# Altium schematic sheet USB.SchDoc: USB
size B; Revision: 1
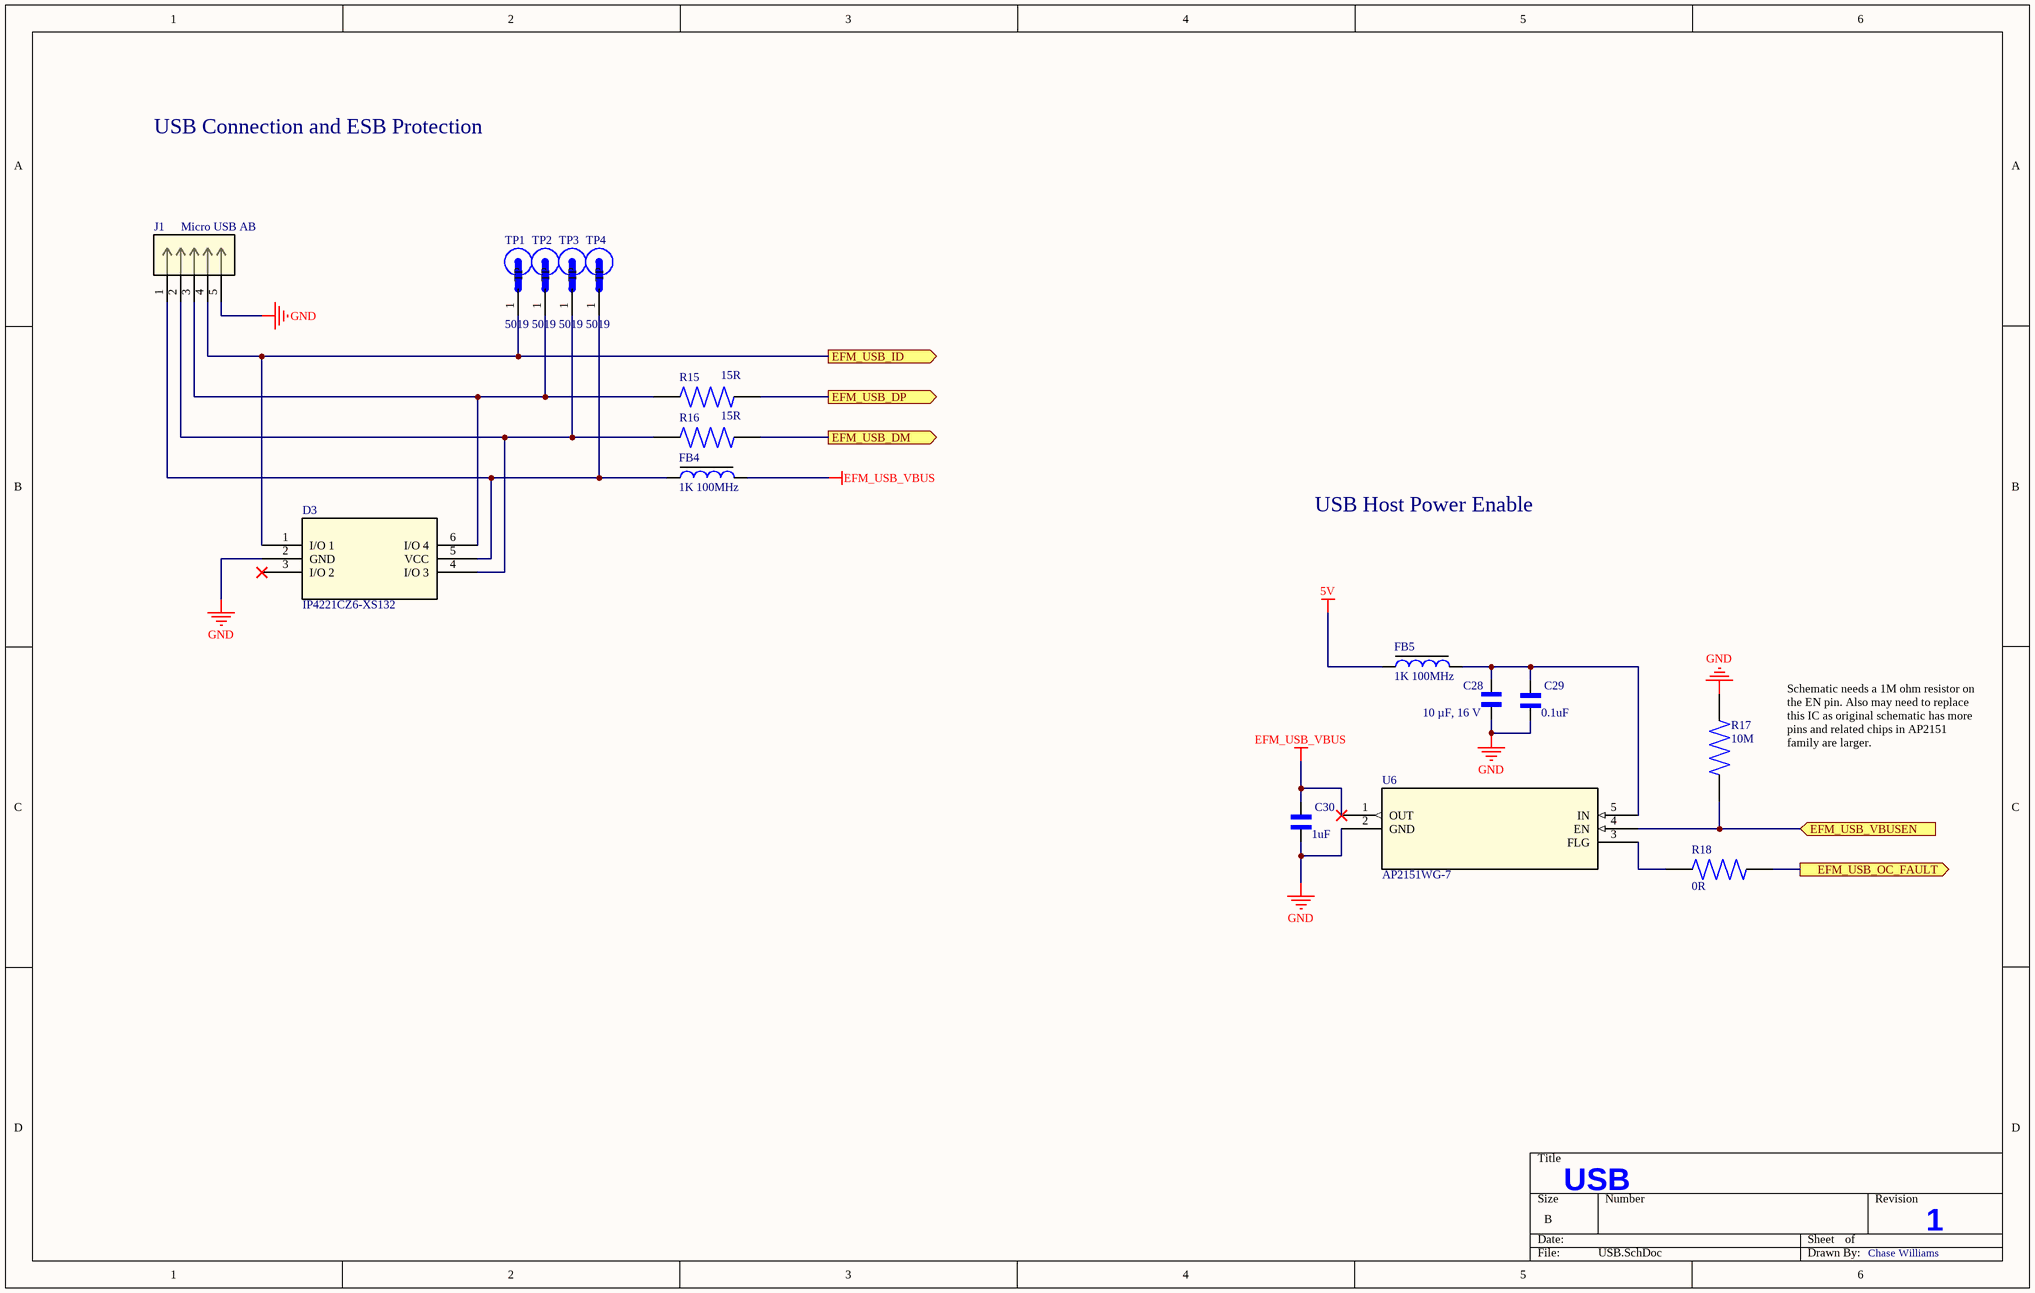
[diagram p0: USB.SchDoc]

## Parts
C28  10 µF, 16 V  [C0805]
C29  0.1uF  [C0402]
C30  1uF  [C0603]
D3  IP4221CZ6-XS132  [SOT886_NEX-M]
FB4  1K 100MHz  [FB0603]
FB5  1K 100MHz  [FB0603]
J1  Micro USB AB  [Molex Micro USB]
R15  15R  [R0402 Vishay]
R16  15R  [R0402 Vishay]
R17  10M  [R0402 Vishay]
R18  0R  [R0805 Yageo]
TP1  5019  [TP380X203]
TP2  5019  [TP380X203]
TP3  5019  [TP380X203]
TP4  5019  [TP380X203]
U6  AP2151WG-7  [AP2151FMG-7]

## Ports
EFM_USB_DM (out), EFM_USB_DP (out), EFM_USB_ID (out), EFM_USB_OC_FAULT (out), EFM_USB_VBUSEN (in)

## Nets
5V: FB5.1
EFM_USB_VBUS: C30.2 FB4.2 U6.1(OUT)
GND: C28.2 C29.1 C30.1 D3.2(GND) J1.5(GND) R17.2 U6.2(GND)
EFM_USB_DM: R16.2 ; port EFM_USB_DM
EFM_USB_DP: R15.2 ; port EFM_USB_DP
EFM_USB_ID: D3.1(I/O_1) J1.4(ID) TP1.1(TP) ; port EFM_USB_ID
EFM_USB_OC_FAULT: R18.2 ; port EFM_USB_OC_FAULT
EFM_USB_VBUSEN: R17.1 U6.4(EN) ; port EFM_USB_VBUSEN
NetC28_1: C28.1 C29.2 FB5.2 U6.5(IN)
NetD3_4: D3.4(I/O_3) J1.2(D-) R16.1 TP3.1(TP)
NetD3_5: D3.5(VCC) FB4.1 J1.1(VBUS) TP4.1(TP)
NetD3_6: D3.6(I/O_4) J1.3(D+) R15.1 TP2.1(TP)
NetR18_1: R18.1 U6.3(FLG)

Not connected (* = marked no-connect by the designer): D3 3(I/O_2)*

## Notes on the sheet
- USB Connection and ESB Protection
- USB Host Power Enable
- Schematic needs a 1M ohm resistor on the EN pin. Also may need to replace this IC as original schematic has more pins and related chips in AP2151 family are larger.
- Chase Williams

## Library data of the parts
C28 = C2012X5R1C106K085AC: TDK - C2012X5R1C106K085AC - SMD Multilayer Ceramic Capacitor, 10 µF, 16 V, 0805 [2012 Metric], ± 10%, X5R, C Series TDK; Capacitance: 10uF; Voltage Rating: 16V; Supplier 1: Digi-Key; Manufacturer: TDK; Manufacturer Part Number: C2012X5R1C106K085AC; RoHS: Yes; Category: Ceramic Capacitors; Stock 1: 1442350; Pricing 1: 1=0.25000, 10=0.17500, 100=0.09890, 500=0.06982, 1000=0.06110 (USD); Mount: Surface Mount; Case/Package: 0805; Number of Pins: 2; Weight: 0.000194oz; Case Code (Metric): 2012; Case Code (Imperial): 0805; Dielectric Material: Ceramic; Min Operating Temperature: -55°C; Max Operating Temperature: 85°C; Tolerance: 10%; Packaging: Tape and Reel; Voltage Rating (DC): 16V; Termination: SMD/SMT; Dielectric: X5R; Package Quantity: 1; Composition: Ceramic; Length: 2mm; Height: 0.85mm; Depth: 1.25mm; Width: 0.049inch; Thickness: 0.037inch; Lead Free: Lead Free; REACH SVHC: No SVHC; ComponentLink1URL: https://datasheet.ciiva.com/24218/c2012x5r1c106k085ac-264980-24218056.pdf?src-supplier=Mouser; ComponentLink1Description: https://datasheet.ciiva.com/24218/c2012x5r1c106k085ac-264980-24218056.pdf?src-supplier=Mouser; ComponentLink2URL: https://datasheet.ciiva.com/28451/1796654-28451610.pdf?src-supplier=Element14; ComponentLink2Description: https://datasheet.ciiva.com/28451/1796654-28451610.pdf?src-supplier=Element14; ComponentLink3URL: https://datasheet.ciiva.com/28602/1744655-28602170.pdf?src-supplier=Element14; ComponentLink3Description: https://datasheet.ciiva.com/28602/1744655-28602170.pdf?src-supplier=Element14; ComponentLink4URL: https://datasheet.ciiva.com/6259/tdkmlcccaprange-6259116.pdf?src-supplier=Digi-Key; ComponentLink4Description: https://datasheet.ciiva.com/6259/tdkmlcccaprange-6259116.pdf?src-supplier=Digi-Key; ComponentLink5URL: https://datasheet.ciiva.com/23803/1796654-23803020.pdf?src-supplier=Newark; ComponentLink5Description: https://datasheet.ciiva.com/23803/1796654-23803020.pdf?src-supplier=Newark; ComponentLink6URL: https://datasheet.ciiva.com/22719/1796654-22719549.pdf?src-supplier=Element14; ComponentLink6Description: https://datasheet.ciiva.com/22719/1796654-22719549.pdf?src-supplier=Element14; ComponentLink7URL: https://datasheet.ciiva.com/6259/tdkmlcccaprange-6259119.pdf?src-supplier=Digi-Key; ComponentLink7Description: https://datasheet.ciiva.com/6259/tdkmlcccaprange-6259119.pdf?src-supplier=Digi-Key; ComponentLink8URL: https://datasheet.ciiva.com/28673/mlcc-commercial-general-en-28673535.pdf?src-supplier=Element14; ComponentLink8Description: https://datasheet.ciiva.com/28673/mlcc-commercial-general-en-28673535.pdf?src-supplier=Element14; Supplier Part Number 1: 445-7644-1-ND
C29 = GRM022R60J104KE15L: CAP CER 0.1UF 6.3V X5R 01005; Manufacturer: Murata; Capacitance: 100nF; Tolerance: 10%; Supplier 1: Digi-Key; Manufacturer Part Number: GRM022R60J104KE15L; RoHS: No; Category: Ceramic Capacitors; Stock 1: 633064; Pricing 1: 1=0.13000, 10=0.09000, 50=0.05080, 100=0.04210, 500=0.02952, 1000=0.02444, 2500=0.02275, 5000=0.02081 (USD); Mount: Surface Mount; Case Code (Imperial): 1005; Case Code (Metric): 0402; Min Operating Temperature: -55°C; Max Operating Temperature: 85°C; Packaging: Cut Tape; Voltage Rating: 6.3V; ComponentLink1URL: http://search.murata.co.jp/Ceramy/image/img/A01X/G101/ENG/GRM022R60J104KE15-01.pdf?src-supplier=Digi-Key; ComponentLink1Description: http://search.murata.co.jp/Ceramy/image/img/A01X/G101/ENG/GRM022R60J104KE15-01.pdf?src-supplier=Digi-Key; Supplier Part Number 1: 490-16598-1-ND
C30 = CL10A105KO8NNNC: SAMSUNG ELECTRO-MECHANICS - CL10A105KO8NNNC - CAP, 1UF, 16V, MLCC, 0603; Material: Ceramic; Tolerance: 10%; Dielectric: X5R; Supplier 1: Digi-Key; Manufacturer: Samsung; Manufacturer Part Number: CL10A105KO8NNNC; RoHS: Yes; Category: Ceramic Capacitors; Stock 1: 1739627; Pricing 1: 1=0.10000, 10=0.03500, 50=0.01920, 100=0.01570, 500=0.01124, 1000=0.00883 (USD); Mount: Surface Mount; Case/Package: 0603; Case Code (Metric): 1608; Case Code (Imperial): 0603; Contact Plating: Tin; Min Operating Temperature: -55°C; Max Operating Temperature: 85°C; Capacitance: 1uF; Package Quantity: 1; Packaging: Tape and Reel; Voltage Rating: 16V; Voltage Rating (DC): 16V; Voltage: 16V; Length: 1.6mm; Width: 0.031inch; Height: 0.8mm; Thickness: 0.035inch; Depth: 0.8mm; Radiation Hardening: No; Lead Free: Lead Free; ComponentLink1URL: https://datasheet.ciiva.com/16199/cl10a105ko8nnnc-16199033.pdf?src-supplier=Future+Electronics; ComponentLink1Description: https://datasheet.ciiva.com/16199/cl10a105ko8nnnc-16199033.pdf?src-supplier=Future+Electronics; ComponentLink2URL: https://datasheet.ciiva.com/15195/getdatasheetpartid-359688-15195706.pdf?src-supplier=Verical; ComponentLink2Description: https://datasheet.ciiva.com/15195/getdatasheetpartid-359688-15195706.pdf?src-supplier=Verical; ComponentLink3URL: https://datasheet.ciiva.com/29198/458190-da-01-en-vs-kondensator-0603-29198480.pdf?src-supplier=Conrad; ComponentLink3Description: https://datasheet.ciiva.com/29198/458190-da-01-en-vs-kondensator-0603-29198480.pdf?src-supplier=Conrad; Supplier Part Number 1: 1276-1034-1-ND
D3 = IP4221CZ6-XS132: TVS DIODE 5.5VWM SOT891; Manufacturer: NXP Semiconductors; Number of Bidirectional Channels: 4; Reverse Standoff Voltage: 5.5V; Min Breakdown Voltage: 6V; Power Line Protection: Yes; Breakdown Voltage: 9V; Leakage Current: 100nA; Direction: Unidirectional; Capacitance: 1.2pF; Supplier 1: Digi-Key; Manufacturer Part Number: IP4221CZ6-XS132; RoHS: Yes; Category: ESD and Circuit Protection ICs; Mount: Surface Mount; Case/Package: DFN; Number of Pins: 6; Min Operating Temperature: -40°C; Max Operating Temperature: 85°C; Number of Channels: 4; Termination: SMD/SMT; Packaging: Tape and Reel; Package Quantity: 1; Length: 1.05mm; Depth: 1.05mm; Radiation Hardening: No; Lead Free: Lead Free; ComponentLink1URL: https://datasheet.ciiva.com/337/ip4221cz6-xs-337188.pdf?src-supplier=Digi-Key; ComponentLink1Description: https://datasheet.ciiva.com/337/ip4221cz6-xs-337188.pdf?src-supplier=Digi-Key; ComponentLink2URL: https://datasheet.ciiva.com/337/ip4221cz6-xs-337189.pdf?src-supplier=Digi-Key; ComponentLink2Description: https://datasheet.ciiva.com/337/ip4221cz6-xs-337189.pdf?src-supplier=Digi-Key; ComponentLink3URL: https://datasheet.ciiva.com/337/ip4221cz6-xs-337190.pdf?src-supplier=Digi-Key; ComponentLink3Description: https://datasheet.ciiva.com/337/ip4221cz6-xs-337190.pdf?src-supplier=Digi-Key; Supplier Part Number 1: 568-6341-2-ND
FB4 FB5 = 742792662: Ferrite Beads Multi-Layer Chip Bead 1KOhm 25% 100MHz 600mA 0603 T/R; Manufacturer: Wurth Electronics; Impedance: 1kR; Number of Lines: 1; DC Resistance (DCR): 300mR; Test Frequency: 120MHz; Supplier 1: Digi-Key; Manufacturer Part Number: 742792662; RoHS: Yes; Category: Ferrite Beads and Chips; Stock 1: 96964; Pricing 1: 1=0.17000, 50=0.16800, 100=0.15500, 500=0.14800, 1000=0.14100, 2000=0.13400 (USD); Mount: Surface Mount; Case/Package: SMD/SMT; Case Code (Metric): 1608; Case Code (Imperial): 0603; Weight: 7.1E-05oz; Material: Ferrite; Min Operating Temperature: -55°C; Max Operating Temperature: 125°C; Package Quantity: 4000; Packaging: Tape and Reel; Tolerance: 25%; Max Current Rating: 600mA; Max DC Current: 600mA; Termination: SMD/SMT; Length: 1.6mm; Width: 0.031inch; Height: 0.8mm; Depth: 0.8mm; Lead Free: Lead Free; ComponentLink1URL: https://datasheet.ciiva.com/29364/742792662-29364469.pdf?src-supplier=Digi-Key; ComponentLink1Description: https://datasheet.ciiva.com/29364/742792662-29364469.pdf?src-supplier=Digi-Key; ComponentLink2URL: https://datasheet.ciiva.com/30489/0900766b812a6756-30489145.pdf?src-supplier=RSComponents; ComponentLink2Description: https://datasheet.ciiva.com/30489/0900766b812a6756-30489145.pdf?src-supplier=RSComponents; ComponentLink3URL: https://datasheet.ciiva.com/29364/742792662-29364471.pdf?src-supplier=Digi-Key; ComponentLink3Description: https://datasheet.ciiva.com/29364/742792662-29364471.pdf?src-supplier=Digi-Key; ComponentLink4URL: https://datasheet.ciiva.com/29364/742792662-29364473.pdf?src-supplier=Digi-Key; ComponentLink4Description: https://datasheet.ciiva.com/29364/742792662-29364473.pdf?src-supplier=Digi-Key; Supplier Part Number 1: 732-4670-1-ND
J1 = Molex Micro USB: https://www.molex.com/molex/products/part-detail/io_connectors/0475890001; Manufacturer_Part_Number: 47589-0001; Vendor: Molex Connector Corporation; Built_By: EMA_Don; SourceLibrary: Molex_2018-12-15; Copyright: Copyright (C) 2016 Accelerated Designs. All rights reserved; RefDes: RefDes; Type: DEV
R15 R16 = CRCW040215R0FKED: VISHAY - CRCW040215R0FKED - SMD Chip Resistor, 0402 [1005 Metric], 15 ohm, CRCW e3 Series, 50 V, Thick Film, 63 mW; Tolerance: 1%; Temperature Coefficient: 100ppm/°C; Power Rating: 63mW; Voltage Rating: 50V; Supplier 1: Digi-Key; Manufacturer: Vishay; Manufacturer Part Number: CRCW040215R0FKED; RoHS: Yes; Category: Chip SMD Resistors; Stock 1: 18; Pricing 1: 1=0.10000, 10=0.03300, 100=0.01330, 1000=0.00596, 2500=0.00518, 5000=0.00428 (USD); Case/Package: 0402; Contact Plating: Tin; Case Code (Imperial): 0402; Case Code (Metric): 1005; Weight: 2.3E-05oz; Min Operating Temperature: -55°C; Max Operating Temperature: 155°C; Resistance: 15R; Resistor Type: Thick Film; Packaging: Tape and Reel; Package Quantity: 10; Termination: SMD/SMT; Number of Terminations: 2; Max Power Dissipation: 63mW; Voltage Rating (DC): 50V; Features: Automotive AEC-Q200; Length: 1mm; Width: 0.5mm; Height: 0.35mm; Depth: 0.5mm; Radiation Hardening: No; REACH SVHC: Unknown; Lead Free: Lead Free; Military Standard: Not; ComponentLink1URL: https://datasheet.ciiva.com/11812/0900766b80d98824-11812193.pdf?src-supplier=RSComponents; ComponentLink1Description: https://datasheet.ciiva.com/11812/0900766b80d98824-11812193.pdf?src-supplier=RSComponents; ComponentLink2URL: https://datasheet.ciiva.com/5550/dcrcwe3-109170-5550213.pdf?src-supplier=Mouser; ComponentLink2Description: https://datasheet.ciiva.com/5550/dcrcwe3-109170-5550213.pdf?src-supplier=Mouser; ComponentLink3URL: https://datasheet.ciiva.com/2463/dcrcwe3-2463641.pdf?src-supplier=Digi-Key; ComponentLink3Description: https://datasheet.ciiva.com/2463/dcrcwe3-2463641.pdf?src-supplier=Digi-Key; ComponentLink4URL: https://datasheet.ciiva.com/2463/dcrcwe3-2463642.pdf?src-supplier=Digi-Key; ComponentLink4Description: https://datasheet.ciiva.com/2463/dcrcwe3-2463642.pdf?src-supplier=Digi-Key; ComponentLink5URL: https://datasheet.ciiva.com/16778/70201119-16778045.pdf?src-supplier=Allied+Electronics; ComponentLink5Description: https://datasheet.ciiva.com/16778/70201119-16778045.pdf?src-supplier=Allied+Electronics; ComponentLink6URL: https://datasheet.ciiva.com/7777/1697337-7777205.pdf?src-supplier=Element14; ComponentLink6Description: https://datasheet.ciiva.com/7777/1697337-7777205.pdf?src-supplier=Element14; ComponentLink7URL: https://datasheet.ciiva.com/2463/dcrcwe3-2463640.pdf?src-supplier=Digi-Key; ComponentLink7Description: https://datasheet.ciiva.com/2463/dcrcwe3-2463640.pdf?src-supplier=Digi-Key; ComponentLink8URL: https://datasheet.ciiva.com/26316/fld-crcw-e3-data-en-26316664.pdf?src-supplier=Distrelec; ComponentLink8Description: https://datasheet.ciiva.com/26316/fld-crcw-e3-data-en-26316664.pdf?src-supplier=Distrelec; ComponentLink9URL: https://datasheet.ciiva.com/16880/dcrcwe3-16880876.pdf?src-supplier=Avnet+Europe; ComponentLink9Description: https://datasheet.ciiva.com/16880/dcrcwe3-16880876.pdf?src-supplier=Avnet+Europe; ComponentLink10URL: https://datasheet.ciiva.com/22869/70201119-22869118.pdf?src-supplier=Allied+Electronics; ComponentLink10Description: https://datasheet.ciiva.com/22869/70201119-22869118.pdf?src-supplier=Allied+Electronics; ComponentLink11URL: https://datasheet.ciiva.com/16393/dcrcwe3-16393535.pdf?src-supplier=Future+Electronics; ComponentLink11Description: https://datasheet.ciiva.com/16393/dcrcwe3-16393535.pdf?src-supplier=Future+Electronics; ComponentLink12URL: https://datasheet.ciiva.com/22740/1533075-22740367.pdf?src-supplier=Element14; ComponentLink12Description: https://datasheet.ciiva.com/22740/1533075-22740367.pdf?src-supplier=Element14; Supplier Part Number 1: 541-15.0LCT-ND
R17 = CRCW040210M0FKED: RESISTOR, 0402, 10M, 1%, FULL REEL; Product Range:VISHAY - AEC-Q200 CRCW Series; Resistance:10Mohm; Power Rating:63mW; Resistance Tolerance:± 1%; Resistor Case Style:0402 [1005 Metric]; Resistor Element Material:Thick Film; ;RoHS Compliant: Yes; Manufacturer: Vishay; Resistance: 10MR; Temperature Coefficient: 100ppm/°C; Max Power Dissipation: 63mW; Voltage Rating: 50V; Supplier 1: Digi-Key; Manufacturer Part Number: CRCW040210M0FKED; RoHS: Yes; Category: Chip SMD Resistors; Stock 1: 167645; Pricing 1: 1=0.10000, 10=0.03300, 100=0.01330, 1000=0.00596, 2500=0.00518, 5000=0.00428 (USD); Mount: Surface Mount; Case/Package: 0402; Case Code (Metric): 1005; Case Code (Imperial): 0402; Weight: 2.3E-05oz; Contact Plating: Tin; Min Operating Temperature: -55°C; Max Operating Temperature: 155°C; Resistor Type: Thick Film; Tolerance: 1%; Packaging: Tape and Reel; Number of Terminations: 2; Power Rating: 63mW; Package Quantity: 10; Termination: SMD/SMT; Voltage Rating (DC): 50V; Features: Automotive AEC-Q200; Length: 1mm; Width: 0.02inch; Height: 0.35mm; Depth: 0.5mm; Radiation Hardening: No; REACH SVHC: Unknown; Military Standard: Not; Lead Free: Lead Free; ComponentLink1URL: https://datasheet.ciiva.com/11811/0900766b80d98824-11811586.pdf?src-supplier=RSComponents; ComponentLink1Description: https://datasheet.ciiva.com/11811/0900766b80d98824-11811586.pdf?src-supplier=RSComponents; ComponentLink2URL: https://datasheet.ciiva.com/2463/dcrcwe3-2463089.pdf?src-supplier=Digi-Key; ComponentLink2Description: https://datasheet.ciiva.com/2463/dcrcwe3-2463089.pdf?src-supplier=Digi-Key; ComponentLink3URL: https://datasheet.ciiva.com/2463/dcrcwe3-2463088.pdf?src-supplier=Digi-Key; ComponentLink3Description: https://datasheet.ciiva.com/2463/dcrcwe3-2463088.pdf?src-supplier=Digi-Key; ComponentLink4URL: https://datasheet.ciiva.com/2463/dcrcwe3-2463090.pdf?src-supplier=Digi-Key; ComponentLink4Description: https://datasheet.ciiva.com/2463/dcrcwe3-2463090.pdf?src-supplier=Digi-Key; ComponentLink5URL: https://datasheet.ciiva.com/5552/dcrcwe3-109170-5552597.pdf?src-supplier=Mouser; ComponentLink5Description: https://datasheet.ciiva.com/5552/dcrcwe3-109170-5552597.pdf?src-supplier=Mouser; ComponentLink6URL: https://datasheet.ciiva.com/16881/dcrcwe3-16881451.pdf?src-supplier=Avnet+Europe; ComponentLink6Description: https://datasheet.ciiva.com/16881/dcrcwe3-16881451.pdf?src-supplier=Avnet+Europe; ComponentLink7URL: https://datasheet.ciiva.com/26316/fld-crcw-e3-data-en-26316614.pdf?src-supplier=Distrelec; ComponentLink7Description: https://datasheet.ciiva.com/26316/fld-crcw-e3-data-en-26316614.pdf?src-supplier=Distrelec; ComponentLink8URL: https://datasheet.ciiva.com/16773/70201119-16773258.pdf?src-supplier=Allied+Electronics; ComponentLink8Description: https://datasheet.ciiva.com/16773/70201119-16773258.pdf?src-supplier=Allied+Electronics; Supplier Part Number 1: 541-10.0MLCT-ND
R18 = RC0805JR-070RL: Surface Mount Thick Film Resistor, RC Series, 125 mW, - 5%, 150 V, 0805 [2012 Metric]; Manufacturer: Yageo; Resistance: 0mR; Power Rating: 125mW; Voltage Rating: 150V; Temperature Coefficient: 200ppm/°C; Supplier 1: Digi-Key; Manufacturer Part Number: RC0805JR-070RL; RoHS: Yes; Category: Chip SMD Resistors; Stock 1: 7454053; Pricing 1: 1=0.10000, 10=0.03500, 25=0.02480, 50=0.01900, 100=0.01400, 250=0.01072, 500=0.00856, 1000=0.00631 (USD); Case/Package: 0805; Number of Pins: 2; Contact Plating: Tin,Matte; Case Code (Imperial): 0805; Case Code (Metric): 2012; Min Operating Temperature: -55°C; Max Operating Temperature: 155°C; Composition: Thick Film; Tolerance: 5%; Packaging: Tape and Reel; Voltage Rating (DC): 150V; Termination: SMD/SMT; Military Standard: Not; Length: 2mm; Height: 0.5mm; Width: 1.25mm; Depth: 1.25mm; Radiation Hardening: No; REACH SVHC: Unknown; Lead Free: Lead Free; ComponentLink1URL: https://datasheet.ciiva.com/7941/1738694-7941861.pdf?src-supplier=Element14; ComponentLink1Description: https://datasheet.ciiva.com/7941/1738694-7941861.pdf?src-supplier=Element14; ComponentLink2URL: https://datasheet.ciiva.com/11819/0900766b8106beab-11819430.pdf?src-supplier=RSComponents; ComponentLink2Description: https://datasheet.ciiva.com/11819/0900766b8106beab-11819430.pdf?src-supplier=RSComponents; ComponentLink3URL: https://datasheet.ciiva.com/7941/1738694-7941862.pdf?src-supplier=Element14; ComponentLink3Description: https://datasheet.ciiva.com/7941/1738694-7941862.pdf?src-supplier=Element14; ComponentLink4URL: https://datasheet.ciiva.com/7941/1738694-7941863.pdf?src-supplier=Element14; ComponentLink4Description: https://datasheet.ciiva.com/7941/1738694-7941863.pdf?src-supplier=Element14; ComponentLink5URL: https://datasheet.ciiva.com/15190/getdatasheetpartid-330685-15190028.pdf?src-supplier=Verical; ComponentLink5Description: https://datasheet.ciiva.com/15190/getdatasheetpartid-330685-15190028.pdf?src-supplier=Verical; Supplier Part Number 1: 311-0.0ARCT-ND
TP1-TP4 = 5019: PC Test Point, Miniature Phosphor Bronze, Silver Plating Surface Mount Mounting Type; MF: Keystone Electronics; Value: *; MP: 5019; Package: 2010 Keystone; SnapEDA_Link: https://www.snapeda.com/parts/5019/Keystone%20Electronics/view-part/449144/?ref=snap; Digi-Key_Part_Number: 36-5019CT-ND; Digi-Key_Purchase_URL: https://www.digikey.com/product-detail/en/keystone-electronics/5019/36-5019CT-ND/3907344?utm_source=snapeda&utm_medium=aggregator&utm_campaign=symbol
U6 = AP2151WG-7: U400; Vendor: Diodes Inc; Built_By: EMA_UL_Team; SourceLibrary: DIODESINC_2_2015-08-18; Manufacturer_Part_Number: AP2151WG-7; Copyright: Copyright (C) 2018 Accelerated Designs. All rights reserved; RefDes: RefDes; Type: DEV